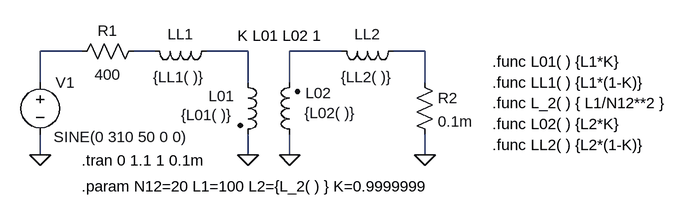
[diagram p0: schematic Trans3.asc]
Trans3.asc, the LTspice schematic file:
Version 4
SHEET 1 904 680
WIRE -48 48 -112 48
WIRE 64 48 32 48
WIRE 208 48 144 48
WIRE 352 48 272 48
WIRE 480 48 432 48
WIRE -112 96 -112 48
WIRE 208 96 208 48
WIRE 272 96 272 48
WIRE 480 96 480 48
WIRE -112 208 -112 176
WIRE 208 208 208 176
WIRE 272 208 272 176
WIRE 480 208 480 176
FLAG -112 208 0
FLAG 208 208 0
FLAG 272 208 0
FLAG 480 208 0
SYMBOL ind2 192 80 R0
WINDOW 0 -45 37 Left 0
WINDOW 3 -87 66 Left 0
SYMATTR InstName L01
SYMATTR Value {L01( )}
SYMATTR Type ind
SYMBOL ind2 288 192 R180
WINDOW 0 -49 80 Left 0
WINDOW 3 -87 49 Left 0
SYMATTR InstName L02
SYMATTR Value {L02( )}
SYMATTR Type ind
SYMBOL res 48 32 R90
WINDOW 0 0 56 VBottom 0
WINDOW 3 36 56 VTop 0
SYMATTR InstName R1
SYMATTR Value 400
SYMBOL res 464 80 R0
SYMATTR InstName R2
SYMATTR Value 0.1m
SYMBOL voltage -112 80 R0
WINDOW 3 21 100 Left 0
WINDOW 123 0 0 Left 0
WINDOW 39 0 0 Left 0
SYMATTR Value SINE(0 310 50 0 0)
SYMATTR InstName V1
SYMBOL ind 160 32 R90
WINDOW 0 5 56 VBottom 0
WINDOW 3 40 58 VTop 0
SYMATTR InstName LL1
SYMATTR Value {LL1( )}
SYMBOL ind 448 32 R90
WINDOW 0 5 56 VBottom 0
WINDOW 3 40 57 VTop 0
SYMATTR InstName LL2
SYMATTR Value {LL2( )}
TEXT -48 216 Left 0 !.tran 0 1.1 1 0.1m
TEXT 192 24 Left 0 !K L01 L02 1
TEXT -48 256 Left 0 !.param N12=20 L1=100 L2={L_2( ) } K=0.9999999
TEXT 584 128 Left 0 !.func L_2( ) { L1/N12**2 }
TEXT 584 64 Left 0 !.func L01( ) {L1*K}
TEXT 584 96 Left 0 !.func LL1( ) {L1*(1-K)}
TEXT 584 160 Left 0 !.func L02( ) {L2*K}
TEXT 584 192 Left 0 !.func LL2( ) {L2*(1-K)}

The netlist it stands for:
* Trans3.asc
L01 N003 0 {L01( )}
L02 0 N004 {L02( )}
R1 N002 N001 400
R2 N005 0 0.1m
V1 N001 0 SINE(0 310 50 0 0)
LL1 N003 N002 {LL1( )}
LL2 N005 N004 {LL2( )}
.tran 0 1.1 1 0.1m
K L01 L02 1
.param N12=20 L1=100 L2={L_2( ) } K=0.9999999
.func L_2( ) { L1/N12**2 }
.func L01( ) {L1*K}
.func LL1( ) {L1*(1-K)}
.func L02( ) {L2*K}
.func LL2( ) {L2*(1-K)}
.backanno
.end